# EAGLE design HTSSOP to DIL (EAGLE 6.0)
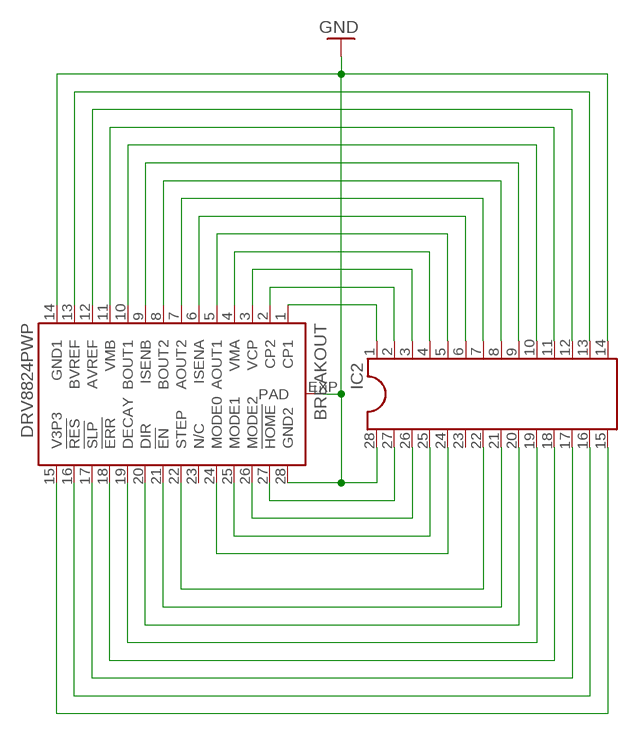
[diagram p0: schematic, sheet 1]

## Parts
BREAKOUT  DRV8824PWP  [HTSSOP28PWP]
IC2  DIL28  [DIL28-6]

## Nets
!EN: BREAKOUT.21(!EN) IC2.21
!ERR: BREAKOUT.18(!ERR) IC2.18
!HOME: BREAKOUT.27(!HOME) IC2.27
!RES: BREAKOUT.16(!RES) IC2.16
!SLP: BREAKOUT.17(!SLP) IC2.17
AOUT1: BREAKOUT.5(AOUT1) IC2.5
AOUT2: BREAKOUT.7(AOUT2) IC2.7
AVREF: BREAKOUT.12(AVREF) IC2.12
BOUT1: BREAKOUT.10(BOUT1) IC2.10
BOUT2: BREAKOUT.8(BOUT2) IC2.8
BVREF: BREAKOUT.13(BVREF) IC2.13
CP1: BREAKOUT.1(CP1) IC2.1
CP2: BREAKOUT.2(CP2) IC2.2
DECAY: BREAKOUT.19(DECAY) IC2.19
DIR: BREAKOUT.20(DIR) IC2.20
GND: BREAKOUT.14(GND1) BREAKOUT.28(GND2) BREAKOUT.EXP(PAD) IC2.14 IC2.28
ISENA: BREAKOUT.6(ISENA) IC2.6
ISENB: BREAKOUT.9(ISENB) IC2.9
MODE0: BREAKOUT.24(MODE0) IC2.24
MODE1: BREAKOUT.25(MODE1) IC2.25
MODE2: BREAKOUT.26(MODE2) IC2.26
STEP: BREAKOUT.22(STEP) IC2.22
V3P3: BREAKOUT.15(V3P3) IC2.15
VCP: BREAKOUT.3(VCP) IC2.3
VMA: BREAKOUT.4(VMA) IC2.4
VMB: BREAKOUT.11(VMB) IC2.11
Unconnected: BREAKOUT.23(N/C) IC2.23

## Library data of the parts
BREAKOUT = texas:DRV8824
IC2 = ic-package:DIL28: Dual In Line

## Board
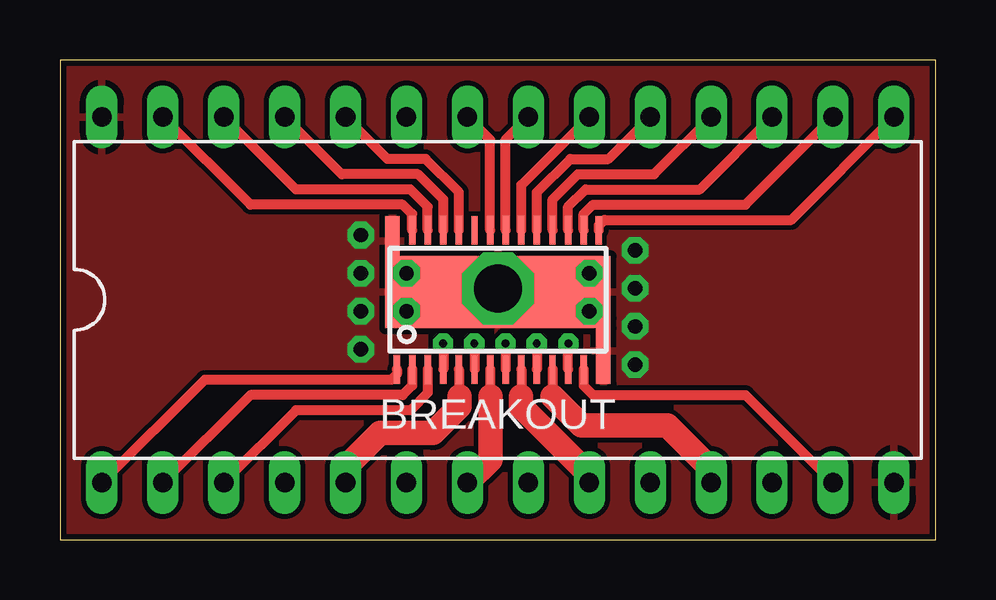
[diagram p1: board, top side]
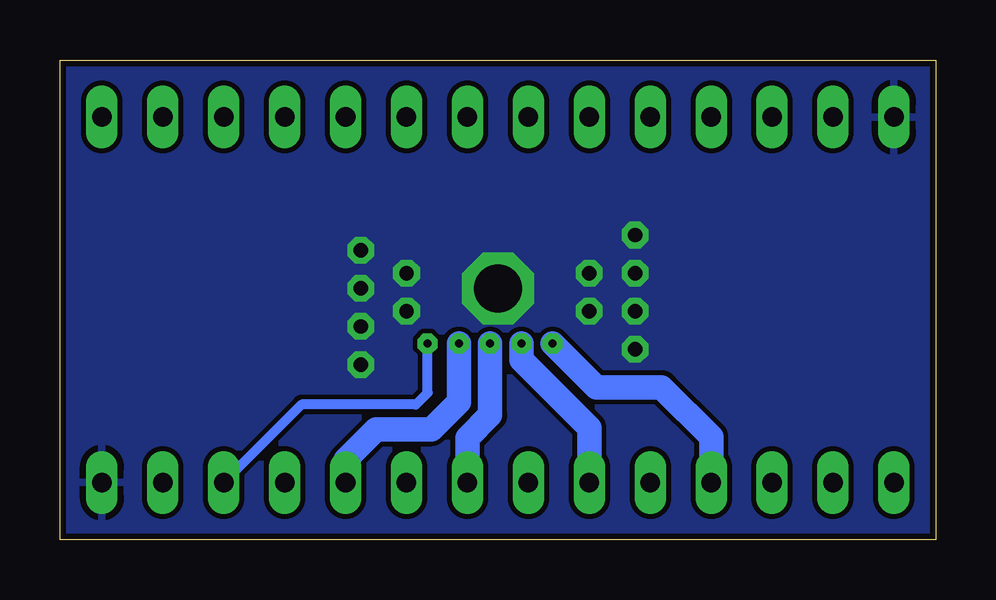
[diagram p2: board, bottom side, seen from below]

Size 36.51 x 20 mm. Coordinates in mm from the lower left corner, seen from the top.
Outline: 0,0 36.51,0 36.51,20 0,20 0,0
Copper layers (1*16): Top 0.035mm / dielectric 1.5mm / Bottom 0.035mm
Design rules: minimum track width 0.2mm, minimum drill 13mil, track to track 0.2mm, track to pad 0.2mm, pad to pad 0.2mm, via to via 0.2mm, smd to smd 0mil, copper to edge 10mil, drill to drill 0.2mm, minimum pad ring 10mil, minimum via ring 10mil, stop-mask expansion 0.125mm, vias tented up to drill 20mil, thermal gap 10mil

### Footprints (pad centres in the part's own frame; a part is rotated, then mirrored left to right if it is on the bottom)
HTSSOP28PWP = smd 0.27 x 1.2: 1 -4.21,-2.9; 2 -3.575,-2.9; 3 -2.925,-2.9; 4 -2.275,-2.9; 5 -1.625,-2.9; 6 -0.975,-2.9; 7 -0.325,-2.9; 8 0.325,-2.9; 9 0.975,-2.9; 10 1.625,-2.9; 11 2.275,-2.9; 12 2.925,-2.9; 13 3.575,-2.9; 15 4.21,2.9; 16 3.575,2.9; 17 2.925,2.9; 18 2.275,2.9; 19 1.625,2.9; 20 0.975,2.9; 21 0.325,2.9; 22 -0.325,2.9; 23 -0.975,2.9; 24 -1.625,2.9; 25 -2.275,2.9; 26 -2.925,2.9; 27 -3.575,2.9 | smd 0.61 x 2.735: 14 4.395,-2.132 | smd 0.61 x 2.1: 28 -4.395,2.45 | smd 9.4 x 3: EXP 0,0.318
DIL28-6 = drill 0.813 long: 1 -16.51,-7.62; 2 -13.97,-7.62; 3 -11.43,-7.62; 4 -8.89,-7.62; 5 -6.35,-7.62; 6 -3.81,-7.62; 7 -1.27,-7.62; 8 1.27,-7.62; 9 3.81,-7.62; 10 6.35,-7.62; 11 8.89,-7.62; 12 11.43,-7.62; 13 13.97,-7.62; 14 16.51,-7.62; 15 16.51,7.62; 16 13.97,7.62; 17 11.43,7.62; 18 8.89,7.62; 19 6.35,7.62; 20 3.81,7.62; 21 1.27,7.62; 22 -1.27,7.62; 23 -3.81,7.62; 24 -6.35,7.62; 25 -8.89,7.62; 26 -11.43,7.62; 27 -13.97,7.62; 28 -16.51,7.62

### Placement (x,y rotation side)
BREAKOUT  18.26,10 0 top
IC2  18.26,10 0 top

### Tracks (layer width: path | path; a pad name or v marks a point on that pad's centre or on a via)
!EN
  Top 0.406: BREAKOUT.21 18.58,16.68 IC2.21
!ERR
  Top 0.406: BREAKOUT.18 20.53,14.18 21.59,15.24 24.77,15.24 IC2.18
!HOME
  Top 0.406: BREAKOUT.27 14.68,13.58 14.29,13.97 7.94,13.97 IC2.27
!RES
  Top 0.406: BREAKOUT.16 21.83,13.58 22.23,13.97 28.57,13.97 IC2.16
!SLP
  Top 0.406: BREAKOUT.17 21.18,13.88 21.91,14.61 26.67,14.61 IC2.17
AOUT1
  Top 0.406: 11.91,3.02 IC2.5 | BREAKOUT.5 16.63,6.19 16.66,5.97
  Top 1.016: 11.91,3.02 13.34,4.45 15.56,4.45 16.66,5.56 16.66,5.97
AOUT2
  Top 0.406: BREAKOUT.7 17.93,6.44 17.94,5.97
  Top 1.016: 17.94,5.97 17.94,3.33 IC2.7
AVREF  (via drill 0.33)
  Top 0.406: BREAKOUT.12 21.18,8.16 v21.19,8.18
  Bottom 0.406: IC2.12 26.43,5.64 21.67,5.64 21.18,6.12 21.18,8.16 v21.19,8.18
BOUT1  (via drill 0.33)
  Top 0.406: v19.88,8.18 BREAKOUT.10
  Bottom 1.016: IC2.10 24.61,3.33 23.34,4.6 21.03,4.6 19.88,5.75 v19.88,8.17 v19.88,8.18
BOUT2  (via drill 0.33)
  Top 0.406: v18.58,8.18 BREAKOUT.8
  Bottom 1.016: IC2.8 19.53,4.25 18.58,5.2 v18.58,8.17 v18.58,8.18
BVREF
  Top 0.406: BREAKOUT.13 21.83,6.43 22.23,6.03 28.57,6.03 IC2.13
CP1
  Top 0.406: BREAKOUT.1 14.05,6.9 13.81,6.67 6.03,6.67 IC2.1
CP2
  Top 0.406: BREAKOUT.2 14.68,6.43 14.29,6.03 7.94,6.03 IC2.2
DECAY
  Top 0.406: BREAKOUT.19 19.88,14.48 21.27,15.88 22.86,15.88 IC2.19
DIR
  Top 0.406: BREAKOUT.20 19.23,14.79 IC2.20
GND  (via drill 0.6, 2)
  other vias: 18.26,10.48 12.54,12.7 12.54,11.11 12.54,9.53 12.54,7.94 23.97,7.3 23.97,8.89 23.97,10.48 23.97,12.06 22.07,9.53 22.07,11.11 14.45,11.11 14.45,9.53
  pour Top: 0,20 0,0 36.51,0 36.51,20
  pour Bottom: 0,20 0,0 36.51,0 36.51,20
ISENA  (via drill 0.33)
  Top 0.406: v17.27,8.18 v17.28,8.18 BREAKOUT.6
  Bottom 1.016: IC2.6 14.45,4.66 17.28,7.5 17.28,8.17 v17.27,8.18
ISENB
  Top 0.406: 22.07,2.7 IC2.9 | BREAKOUT.9 19.23,5.87 19.21,5.97
  Top 1.016: 22.07,2.7 19.21,5.56 19.21,5.97
MODE0
  Top 0.406: BREAKOUT.24 16.63,14.48 15.24,15.88 13.65,15.88 IC2.24
MODE1
  Top 0.406: BREAKOUT.25 15.98,14.18 14.92,15.24 11.75,15.24 IC2.25
MODE2
  Top 0.406: BREAKOUT.26 15.33,13.88 14.61,14.61 9.84,14.61 IC2.26
STEP
  Top 0.406: BREAKOUT.22 17.93,16.68 IC2.22
V3P3
  Top 0.406: BREAKOUT.15 22.47,13.1 22.7,13.34 30.48,13.34 IC2.15
VCP
  Top 0.406: BREAKOUT.3 15.33,6.12 14.61,5.4 9.84,5.4 IC2.3
VMA  (via drill 0.33)
  Top 0.406: v15.98,8.18 BREAKOUT.4
  Bottom 1.016: IC2.4 9.37,4.29 11.43,6.35 14.15,6.35 v15.98,8.18
VMB
  Top 0.406: BREAKOUT.11 20.53,5.97 | 27.15,2.94 IC2.11
  Top 1.016: 20.53,5.97 21.74,4.76 25.32,4.76 27.15,2.94